# Altium schematic sheet Server Ethernet.schdoc
size 534 x 323 mm
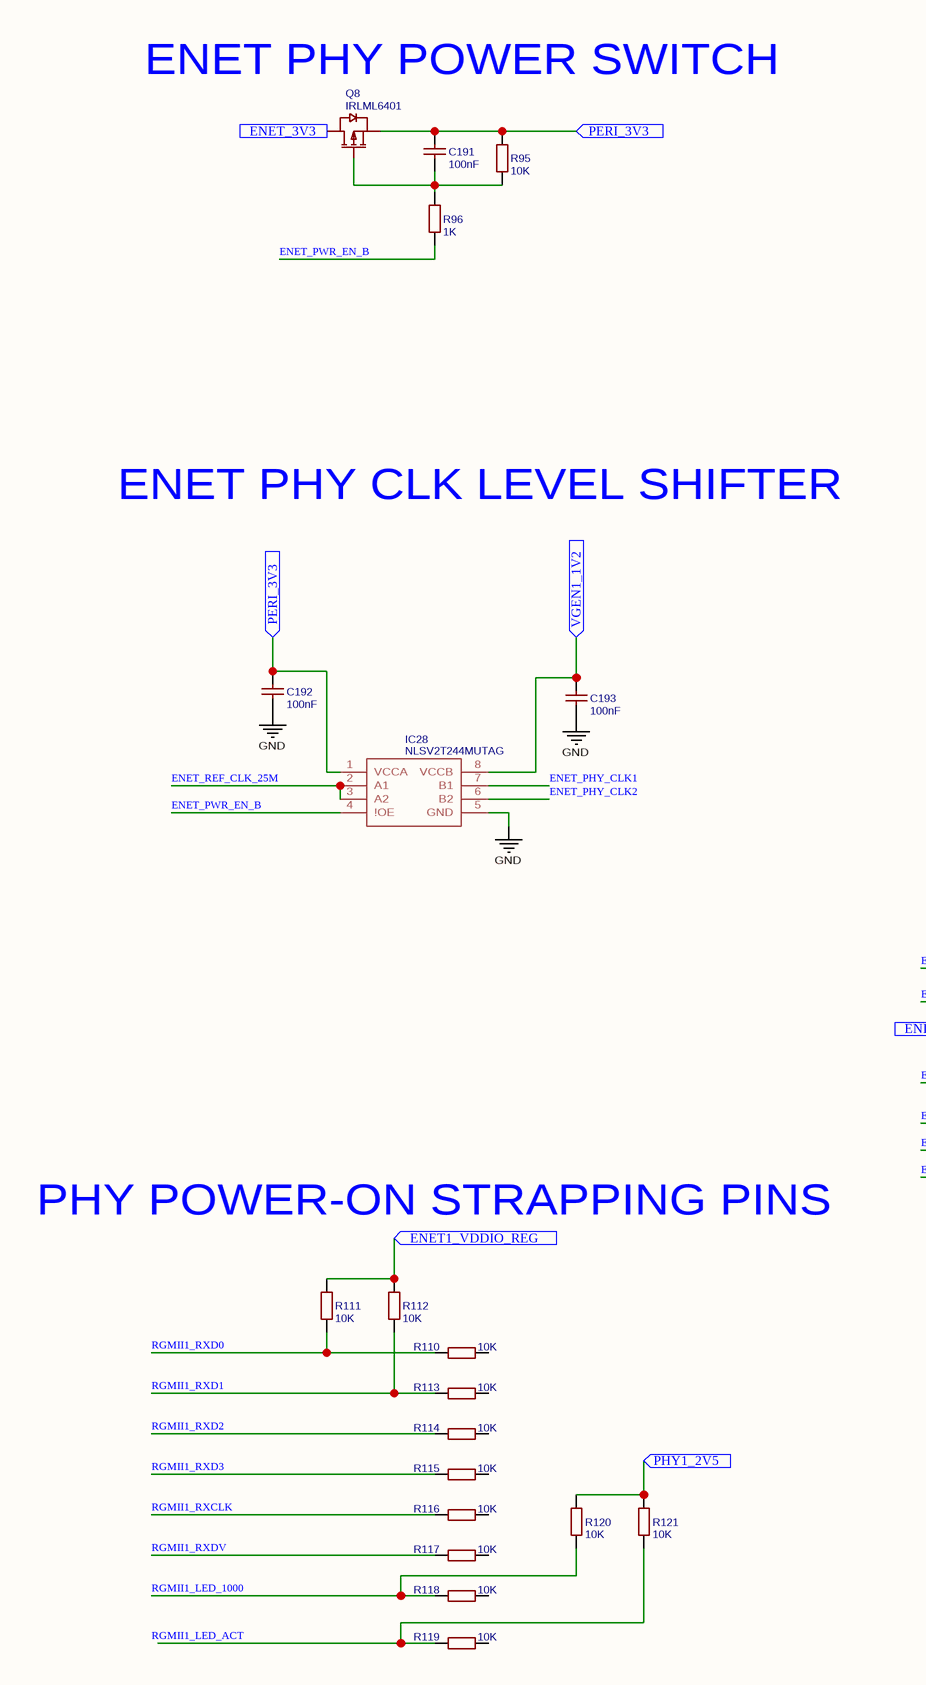
[diagram p0: Server Ethernet.schdoc, left]
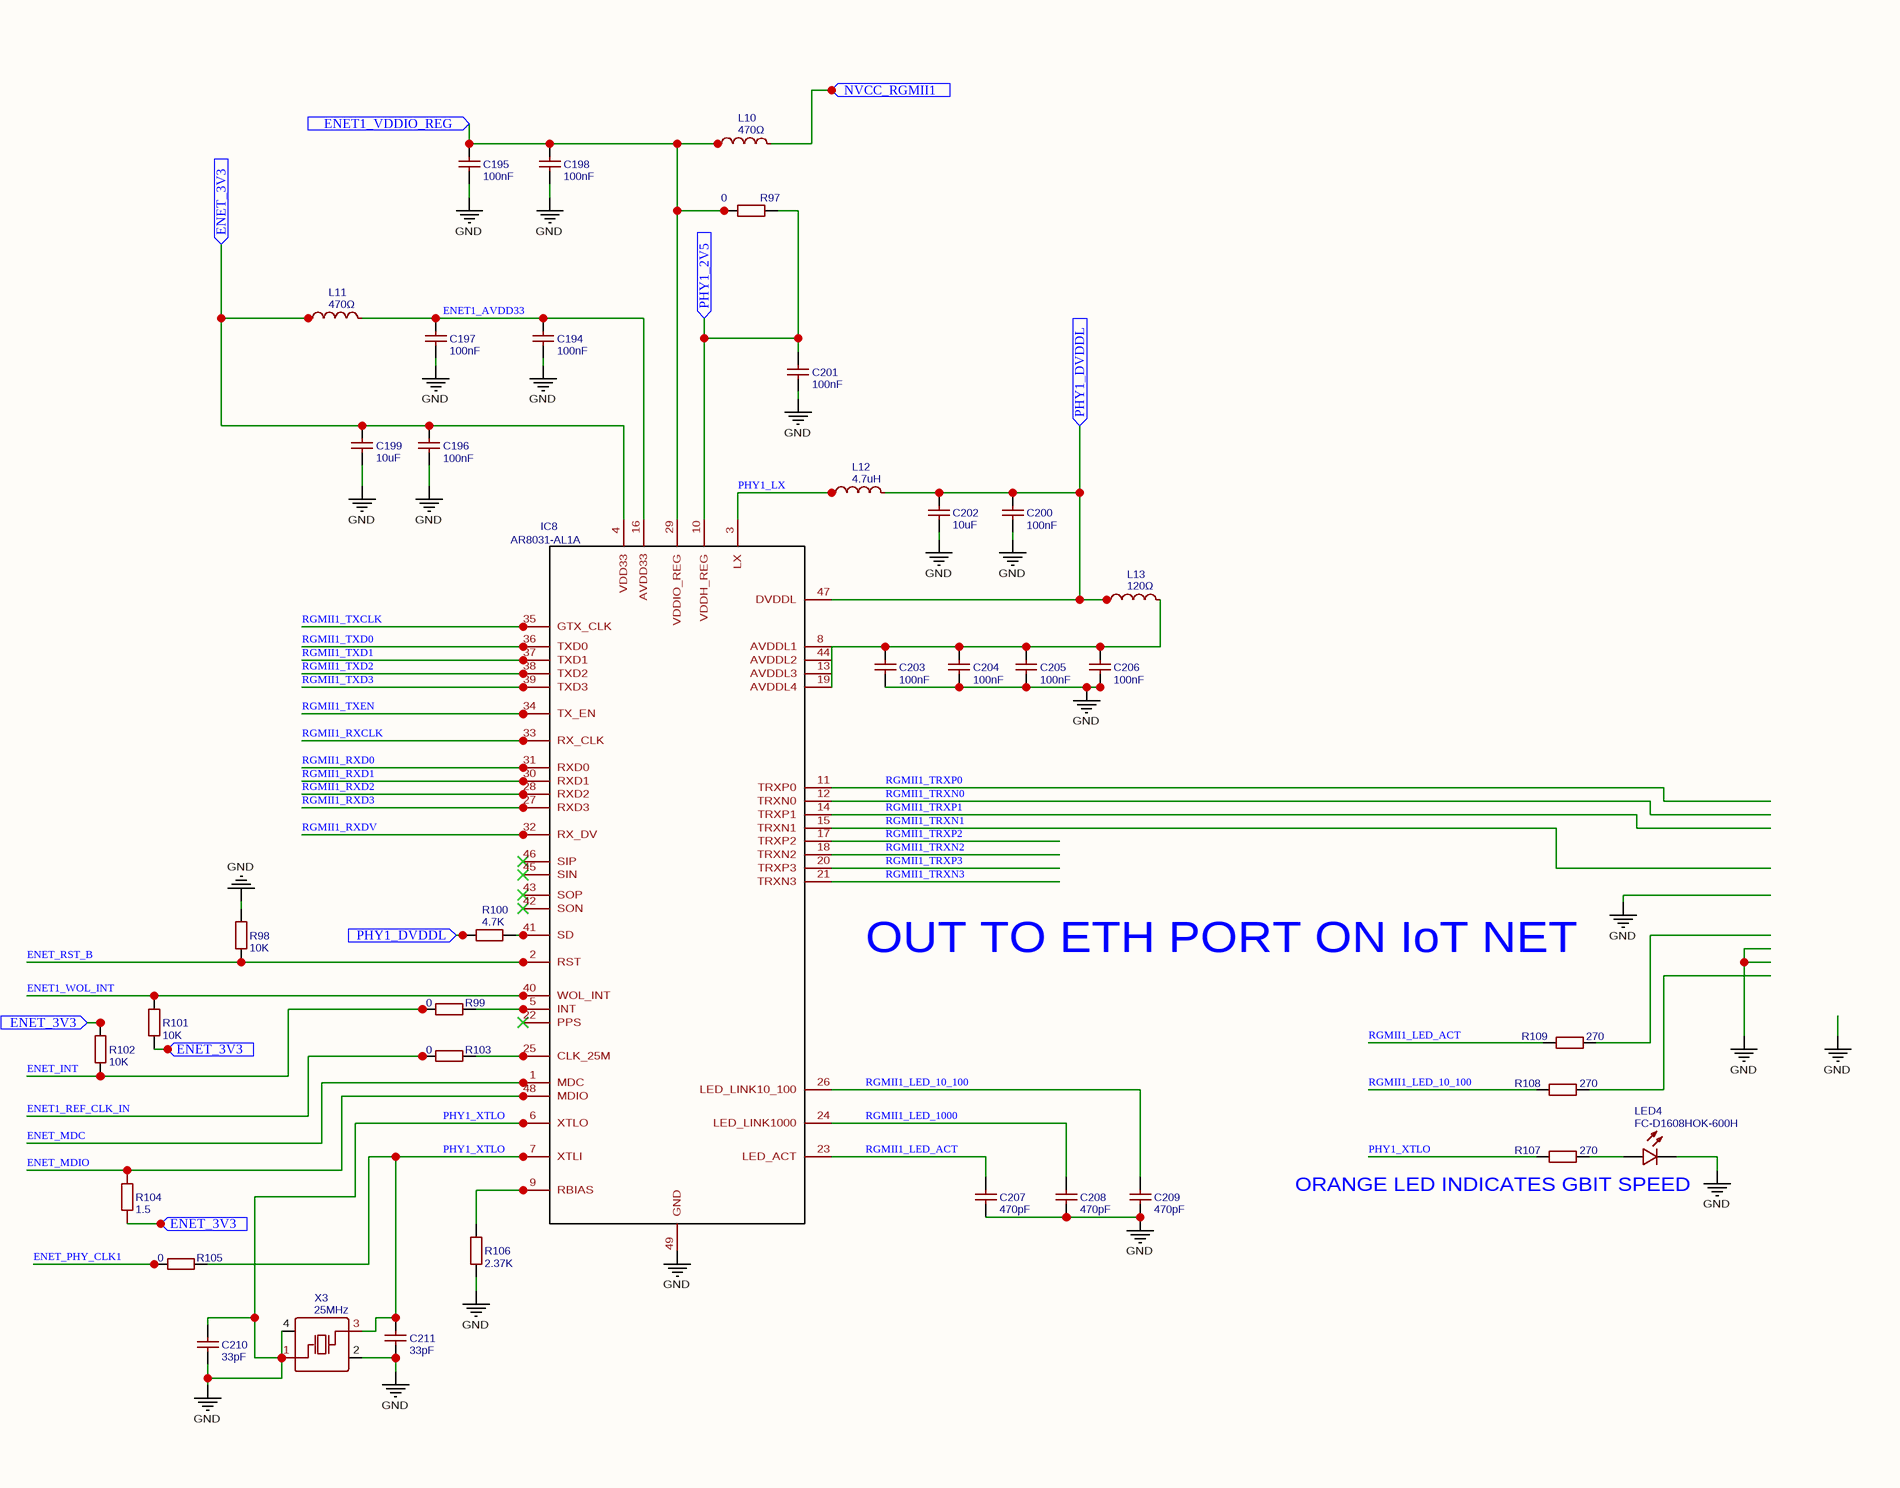
[diagram p1: Server Ethernet.schdoc, right]

## Parts
C191  100nF  [C0603]
C192  100nF  [C0603]
C193  100nF  [C0603]
C194  100nF  [C0603]
C195  100nF  [C0603]
C196  100nF  [C0603]
C197  100nF  [C0603]
C198  100nF  [C0603]
C199  10uF  [C0805]
C200  100nF  [C0603]
C201  100nF  [C0603]
C202  10uF  [C0805]
C203  100nF  [C0603]
C204  100nF  [C0603]
C205  100nF  [C0603]
C206  100nF  [C0603]
C207  470pF  [C0805]
C208  470pF  [C0805]
C209  470pF  [C0805]
C210  33pF  [C0402]
C211  33pF  [C0402]
IC8  AR8031-AL1A  [QFN40P600X600X80-49N]
IC28  NLSV2T244MUTAG  [NLSX4373MUTAG]
L10  470Ω  [L0603]
L11  470Ω  [L0603]
L12  4.7uH  [L0805]
L13  120Ω  [L0603]
LED4  FC-D1608HOK-600H  [LED0603-RD]
Q8  IRLML6401  [SOT-23(SOT-23-3)]
R95  10K  [R0402]
R96  1K  [R0402]
R97  0  [R0402]
R98  10K  [R0402]
R99  0  [R0402]
R100  4.7K  [R0402]
R101  10K  [R0402]
R102  10K  [R0402]
R103  0  [R0402]
R104  1.5  [R0402]
R105  0  [R0402]
R106  2.37K  [R0402]
R107  270  [R0603]
R108  270  [R0603]
R109  270  [R0603]
R110  10K  [R0402]
R111  10K  [R0402]
R112  10K  [R0402]
R113  10K  [R0402]
R114  10K  [R0402]
R115  10K  [R0402]
R116  10K  [R0402]
R117  10K  [R0402]
R118  10K  [R0402]
R119  10K  [R0402]
R120  10K  [R0402]
R121  10K  [R0402]
X3  25MHz  [OSC-SMD_4P-L3.2-W2.5-BL]

## Ports
ENET1_VDDIO_REG (in), ENET_3V3 (in), NVCC_RGMII1 (in), PERI_3V3 (in), PHY1_2V5 (in), PHY1_DVDDL (in), VGEN1_1V2 (in)

## Nets
PHY1_XTLO: C192.1 C193.1 C194.1 C195.1 C196.1 C197.1 C198.1 C199.1 C200.1 C201.1 C202.1 C203.1 C204.1 C205.1 C206.1 C207.1 C208.1 C209.1 C210.1 C210.2 C211.1 C211.2 IC8.6(XTLO) IC8.7(XTLI) IC8.49(GND) IC28.5(GND) LED4.1(K) R98.2 R105.2 R106.1 R107.1 X3.1(OSC1) X3.2(GND) X3.3(OSC2) X3.4(GND)  [also labelled GND]
ENET1_AVDD33: C194.2 C197.2 IC8.16(AVDD33) L11.2
ENET1_REF_CLK_IN: R103.1
ENET1_VDDIO_REG: C195.2 C198.2 IC8.29(VDDIO_REG) L10.1 R97.1 R111.2 R112.2 ; port ENET1_VDDIO_REG
ENET1_WOL_INT: IC8.40(WOL_INT) R101.2
ENET_3V3: C196.2 C199.2 IC8.4(VDD33) L11.1 Q8.3(D) R101.1 R102.2 R104.1 ; port ENET_3V3
ENET_INT: R99.1 R102.1
ENET_MDC: IC8.1(MDC)
ENET_MDIO: IC8.48(MDIO) R104.2
ENET_PHY_CLK1: IC28.7(B1) R105.1
ENET_PHY_CLK2: IC28.6(B2)
ENET_PWR_EN_B: IC28.4(!OE) R96.1
ENET_REF_CLK_25M: IC28.2(A1) IC28.3(A2)
ENET_RST_B: IC8.2(RST) R98.1
NVCC_RGMII1: L10.2 ; port NVCC_RGMII1
PERI_3V3: C191.2 C192.2 IC28.1(VCCA) Q8.2(S) R95.2 ; port PERI_3V3
PHY1_2V5: C201.2 IC8.10(VDDH_REG) R97.2 R120.1 R121.1 ; port PHY1_2V5
PHY1_DVDDL: C200.2 C202.2 IC8.47(DVDDL) L12.2 L13.1 R100.1 ; port PHY1_DVDDL
PHY1_LX: IC8.3(LX) L12.1
RGMII1_LED_10_100: C209.2 IC8.26(LED_LINK10_100) R108.1
RGMII1_LED_1000: C208.2 IC8.24(LED_LINK1000) R118.2 R120.2
RGMII1_LED_ACT: C207.2 IC8.23(LED_ACT) R109.1
RGMII1_RXCLK: IC8.33(RX_CLK) R116.2
RGMII1_RXD0: IC8.31(RXD0) R110.2 R111.1
RGMII1_RXD1: IC8.30(RXD1) R112.1 R113.2
RGMII1_RXD2: IC8.28(RXD2) R114.2
RGMII1_RXD3: IC8.27(RXD3) R115.2
RGMII1_RXDV: IC8.32(RX_DV) R117.2
RGMII1_TRXN0: IC8.12(TRXN0)
RGMII1_TRXN1: IC8.15(TRXN1)
RGMII1_TRXN2: IC8.18(TRXN2)
RGMII1_TRXN3: IC8.21(TRXN3)
RGMII1_TRXP0: IC8.11(TRXP0)
RGMII1_TRXP1: IC8.14(TRXP1)
RGMII1_TRXP2: IC8.17(TRXP2)
RGMII1_TRXP3: IC8.20(TRXP3)
RGMII1_TXCLK: IC8.35(GTX_CLK)
RGMII1_TXD0: IC8.36(TXD0)
RGMII1_TXD1: IC8.37(TXD1)
RGMII1_TXD2: IC8.38(TXD2)
RGMII1_TXD3: IC8.39(TXD3)
RGMII1_TXEN: IC8.34(TX_EN)
VGEN1_1V2: C193.2 IC28.8(VCCB) ; port VGEN1_1V2
NetC191_1: C191.1 Q8.1(G) R95.1 R96.2
NetC203_2: C203.2 C204.2 C205.2 C206.2 IC8.8(AVDDL1) IC8.13(AVDDL3) IC8.19(AVDDL4) IC8.44(AVDDL2) L13.2
NetIC8_5: IC8.5(INT) R99.2
NetIC8_9: IC8.9(RBIAS) R106.2
NetIC8_25: IC8.25(CLK_25M) R103.2
NetIC8_41: IC8.41(SD) R100.2
NetLED4_2: LED4.2(A) R107.2
NetR119_2: R119.2 R121.2

Not connected (* = marked no-connect by the designer): IC8 22(PPS)* 42(SON)* 43(SOP)* 45(SIN)* 46(SIP)*; R108 2; R109 2; R110 1; R113 1; R114 1; R115 1; R116 1; R117 1; R118 1; R119 1

## Notes on the sheet
- ENET PHY POWER SWITCH
- ENET PHY CLK LEVEL SHIFTER
- OUT TO ETH PORT ON IoT NET
- PHY POWER-ON STRAPPING PINS
- (near R107) ORANGE LED INDICATES GBIT SPEED
- Labels drawn without touching a wire or pin: RGMII1_LED_ACT

## Library data of the parts
C191-C198 C200 C201 C203-C206 = 100nF: BOM_Manufacturer: WTC; BOM_Manufacturer Part: 0603B104K250; nameAlias: Capacitance; SMT Type: Extend; BOM_Supplier: LCSC; BOM_Supplier Part: C83054; BOM_LCSC Assembly: Yes; spicePre: C; spiceSymbolName: 0603B104K250
C199 C202 = 10uF: BOM_Manufacturer Part: CL21A106KAYNNNE; BOM_Manufacturer: SAMSUNG; nameAlias: Capacitance; SMT Type: Basic; BOM_Supplier: LCSC; BOM_LCSC Assembly: Yes; BOM_Supplier Part: C15850; spicePre: C; spiceSymbolName: CL21A106KAYNNNE
C207-C209 = 470pF: BOM_Manufacturer: FH; BOM_Manufacturer Part: 0805B471K500NT; nameAlias: Capacitance; SMT Type: Basic; BOM_Supplier: LCSC; BOM_LCSC Assembly: Yes; BOM_Supplier Part: C1743; spicePre: C; spiceSymbolName: 0805B471K500NT
C210 C211 = 33pF: BOM_Manufacturer: FH; BOM_Manufacturer Part: 0402CG330J500NT; nameAlias: Capacitance; SMT Type: Basic; BOM_Supplier: LCSC; BOM_LCSC Assembly: Yes; BOM_Supplier Part: C1562; spicePre: C; spiceSymbolName: 0402CG330J500NT
IC8 = AR8031-AL1A: Contributor: Ke'Ondrae_Mell; spicePre: I; spiceSymbolName: AR8031-AL1A
IC28 = NLSV2T244MUTAG: Contributor: Ke'Ondrae_Mell; spicePre: I; spiceSymbolName: NLSV2T244MUTAG
L10 L11 = 470Ω: BOM_Manufacturer: Sunlord; BOM_Manufacturer Part: GZ1608D471TF; nameAlias: Value; SMT Type: Extend; BOM_Supplier: LCSC; BOM_Supplier Part: C89921; BOM_LCSC Assembly: Yes; spicePre: L; spiceSymbolName: GZ1608D471TF
L12 = 4.7uH: BOM_Manufacturer Part: MLF2012A4R7KT000; BOM_Manufacturer: TDK; nameAlias: Inductance; SMT Type: Extend; BOM_Supplier: LCSC; BOM_Supplier Part: C76736; BOM_LCSC Assembly: Yes; spicePre: L; spiceSymbolName: MLF2012A4R7KT000
L13 = 120Ω: BOM_Manufacturer: MuRata; BOM_Manufacturer Part: BLM18PG121SN1D; nameAlias: Value; SMT Type: Extend; BOM_Supplier: LCSC; BOM_Supplier Part: C73100; BOM_LCSC Assembly: Yes; spicePre: L; spiceSymbolName: BLM18PG121SN1D
LED4 = FC-D1608HOK-600H: BOM_Manufacturer: NATIONSTAR; SMT Type: Extend; BOM_Supplier: LCSC; BOM_Manufacturer Part: FC-D1608HOK-600H; BOM_Supplier Part: C84269; BOM_LCSC Assembly: Yes; spicePre: L; spiceSymbolName: FC-D1608HOK-600H
Q8 = IRLML6401: BOM_Manufacturer: Yenji Elec; Contributor: LCSC; BOM_Supplier: LCSC; BOM_Supplier Part: C236925; BOM_Manufacturer Part: IRLML6401; spicePre: Q; spiceSymbolName: IRLML6401
R95 R98 R101 R102 R110-R121 = 10K: BOM_Manufacturer: UniOhm; BOM_Manufacturer Part: 0402WGF1002TCE; nameAlias: Resistance (Ohms); SMT Type: Basic; BOM_Supplier: LCSC; BOM_LCSC Assembly: Yes; BOM_Supplier Part: C25744; spicePre: R; spiceSymbolName: 0402WGF1002TCE
R96 = 1K: BOM_Manufacturer: UniOhm; BOM_Manufacturer Part: 0402WGF1001TCE; nameAlias: Resistance (Ohms); SMT Type: Basic; BOM_Supplier: LCSC; BOM_LCSC Assembly: Yes; BOM_Supplier Part: C11702; spicePre: R; spiceSymbolName: 0402WGF1001TCE
R97 R99 R103 R105 = 0: BOM_Manufacturer: KOA; BOM_Manufacturer Part: RK73Z1ETTP; nameAlias: Resistance (Ohms); BOM_Supplier: LCSC; BOM_Supplier Part: C131359; spicePre: R; spiceSymbolName: RK73Z1ETTP
R100 = 4.7K: BOM_Manufacturer: UniOhm; BOM_Manufacturer Part: 0402WGF4701TCE; nameAlias: Resistance (Ohms); SMT Type: Basic; BOM_Supplier: LCSC; BOM_LCSC Assembly: Yes; BOM_Supplier Part: C25900; spicePre: R; spiceSymbolName: 0402WGF4701TCE
R104 = 1.5: BOM_Manufacturer: Uniroyal Elec; BOM_Manufacturer Part: 0402WGF150KTCE; nameAlias: Resistance (Ohms); Contributor: LCSC; SMT Type: Extend; BOM_Supplier: LCSC; BOM_Supplier Part: C270642; BOM_LCSC Assembly: Yes; spicePre: R; spiceSymbolName: 0402WGF150KTCE
R106 = 2.37K: BOM_Manufacturer: UniOhm; BOM_Manufacturer Part: 0402WGF2371TCE; nameAlias: Resistance (Ohms); SMT Type: Extend; BOM_Supplier: LCSC; BOM_Supplier Part: C25881; BOM_LCSC Assembly: Yes; spicePre: R; spiceSymbolName: 0402WGF2371TCE
R107-R109 = 270: BOM_Manufacturer: UniOhm; BOM_Manufacturer Part: 0603WAF2700T5E; nameAlias: Resistance (Ohms); SMT Type: Basic; BOM_Supplier: LCSC; BOM_LCSC Assembly: Yes; BOM_Supplier Part: C22966; spicePre: R; spiceSymbolName: 0603WAF2700T5E
X3 = 25MHz: BOM_Manufacturer: YXC; BOM_Manufacturer Part: X322525MOB4SI; nameAlias: Frequency; SMT Type: Basic; BOM_Supplier: LCSC; BOM_LCSC Assembly: Yes; BOM_Supplier Part: C9006; spicePre: X; spiceSymbolName: X322525MOB4SI